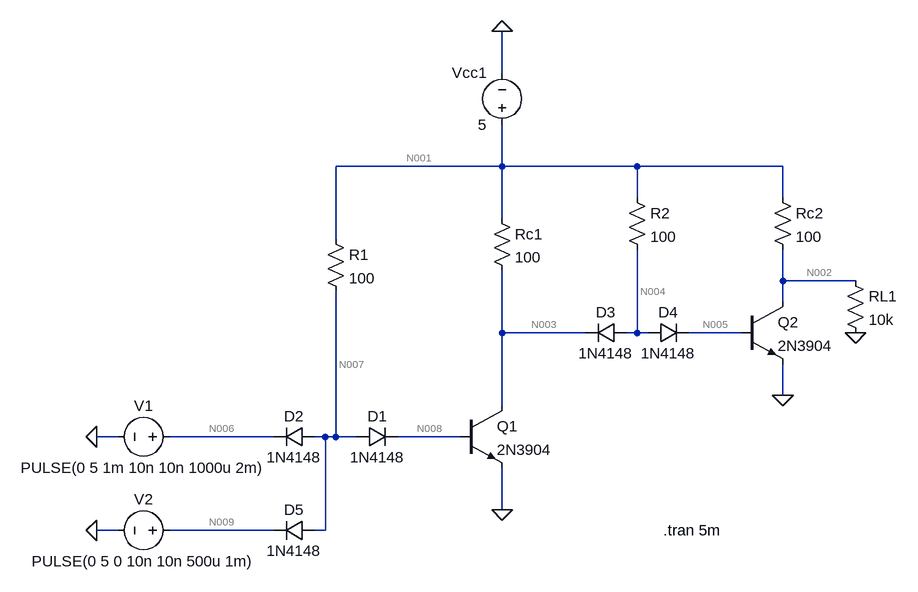
[diagram p0: schematic DTL_AND.asc]
DTL_AND.asc, the LTspice schematic file:
Version 4
SHEET 1 880 680
WIRE 112 -272 112 -336
WIRE 112 -128 112 -192
WIRE 112 -128 -144 -128
WIRE 320 -128 112 -128
WIRE 544 -128 320 -128
WIRE 320 -80 320 -128
WIRE 544 -80 544 -128
WIRE 112 -48 112 -128
WIRE -144 -16 -144 -128
WIRE 544 48 544 0
WIRE 656 48 544 48
WIRE 544 80 544 48
WIRE 112 128 112 32
WIRE 240 128 112 128
WIRE 320 128 320 0
WIRE 320 128 304 128
WIRE 336 128 320 128
WIRE 480 128 400 128
WIRE 544 224 544 176
WIRE 112 240 112 128
WIRE -480 288 -512 288
WIRE -240 288 -400 288
WIRE -160 288 -176 288
WIRE -144 288 -144 64
WIRE -144 288 -160 288
WIRE -112 288 -144 288
WIRE 48 288 -48 288
WIRE 112 400 112 336
WIRE -480 432 -512 432
WIRE -240 432 -400 432
WIRE -160 432 -160 288
WIRE -160 432 -176 432
FLAG -512 288 0
FLAG 112 -336 0
FLAG 112 400 0
FLAG -512 432 0
FLAG 544 224 0
FLAG 656 128 0
SYMBOL diode -112 304 R270
WINDOW 0 32 32 VTop 2
WINDOW 3 0 32 VBottom 2
SYMATTR InstName D1
SYMATTR Value 1N4148
SYMBOL voltage -384 288 R90
WINDOW 0 -32 56 VBottom 2
WINDOW 3 32 56 VTop 2
SYMATTR InstName V1
SYMATTR Value PULSE(0 5 1m 10n 10n 1000u 2m)
SYMBOL res -160 -32 R0
SYMATTR InstName R1
SYMATTR Value 100
SYMBOL voltage 112 -176 R180
WINDOW 0 24 96 Left 2
WINDOW 3 24 16 Left 2
WINDOW 123 0 0 Left 0
WINDOW 39 0 0 Left 0
SYMATTR InstName Vcc1
SYMATTR Value 5
SYMBOL res 96 -64 R0
SYMATTR InstName Rc1
SYMATTR Value 100
SYMBOL npn 48 240 R0
SYMATTR InstName Q1
SYMATTR Value 2N3904
SYMBOL voltage -384 432 R90
WINDOW 0 -32 56 VBottom 2
WINDOW 3 32 56 VTop 2
SYMATTR InstName V2
SYMATTR Value PULSE(0 5 0 10n 10n 500u 1m)
SYMBOL res 304 -96 R0
SYMATTR InstName R2
SYMATTR Value 100
SYMBOL res 528 -96 R0
SYMATTR InstName Rc2
SYMATTR Value 100
SYMBOL npn 480 80 R0
SYMATTR InstName Q2
SYMATTR Value 2N3904
SYMBOL diode -176 272 R90
WINDOW 0 0 32 VBottom 2
WINDOW 3 32 32 VTop 2
SYMATTR InstName D2
SYMATTR Value 1N4148
SYMBOL diode 304 112 R90
WINDOW 0 0 32 VBottom 2
WINDOW 3 32 32 VTop 2
SYMATTR InstName D3
SYMATTR Value 1N4148
SYMBOL diode 336 144 R270
WINDOW 0 32 32 VTop 2
WINDOW 3 0 32 VBottom 2
SYMATTR InstName D4
SYMATTR Value 1N4148
SYMBOL diode -176 416 R90
WINDOW 0 0 32 VBottom 2
WINDOW 3 32 32 VTop 2
SYMATTR InstName D5
SYMATTR Value 1N4148
SYMBOL res 640 32 R0
SYMATTR InstName RL1
SYMATTR Value 10k
TEXT 360 432 Left 2 !.tran 5m

The netlist it stands for:
* DTL_AND.asc
D1 N007 N008 1N4148
V1 N006 0 PULSE(0 5 1m 10n 10n 1000u 2m)
R1 N001 N007 100
Vcc1 N001 0 5
Rc1 N001 N003 100
Q1 N003 N008 0 0 2N3904
V2 N009 0 PULSE(0 5 0 10n 10n 500u 1m)
R2 N001 N004 100
Rc2 N001 N002 100
Q2 N002 N005 0 0 2N3904
D2 N007 N006 1N4148
D3 N004 N003 1N4148
D4 N004 N005 1N4148
D5 N007 N009 1N4148
RL1 N002 0 10k
.model D D
.lib standard.dio
.model NPN NPN
.model PNP PNP
.lib standard.bjt
.tran 5m
.backanno
.end

* Results of the author's LTspice run, read from the files saved beside the schematic
* Operating Point, zero values left out:
*   V(n007) = 734.9 mV
*   V(n008) = 565.4 mV
*   V(n001) = 5 V
*   V(n003) = 4.997 V
*   V(n004) = 2.129 V
*   V(n002) = 30.43 mV
*   V(n005) = 1.377 V
*   Ic(Q2) = 49.69 mA
*   Ib(Q2) = 28.71 mA
*   Ie(Q2) = -78.4 mA
*   Ic(Q1) = 32.51 µA
*   Ib(Q1) = 103.8 nA
*   Ie(Q1) = -32.61 µA
*   I(D5) = 21.33 mA
*   I(D4) = 28.71 mA
*   I(D3) = -2.523 nA
*   I(D2) = 21.33 mA
*   I(D1) = 103.8 nA
*   I(Rl1) = 3.043 µA
*   I(Rc2) = 49.7 mA
*   I(R2) = 28.71 mA
*   I(Rc1) = 32.51 µA
*   I(R1) = 42.65 mA
*   I(V2) = 21.33 mA
*   I(Vcc1) = -121.1 mA
*   I(V1) = 21.33 mA
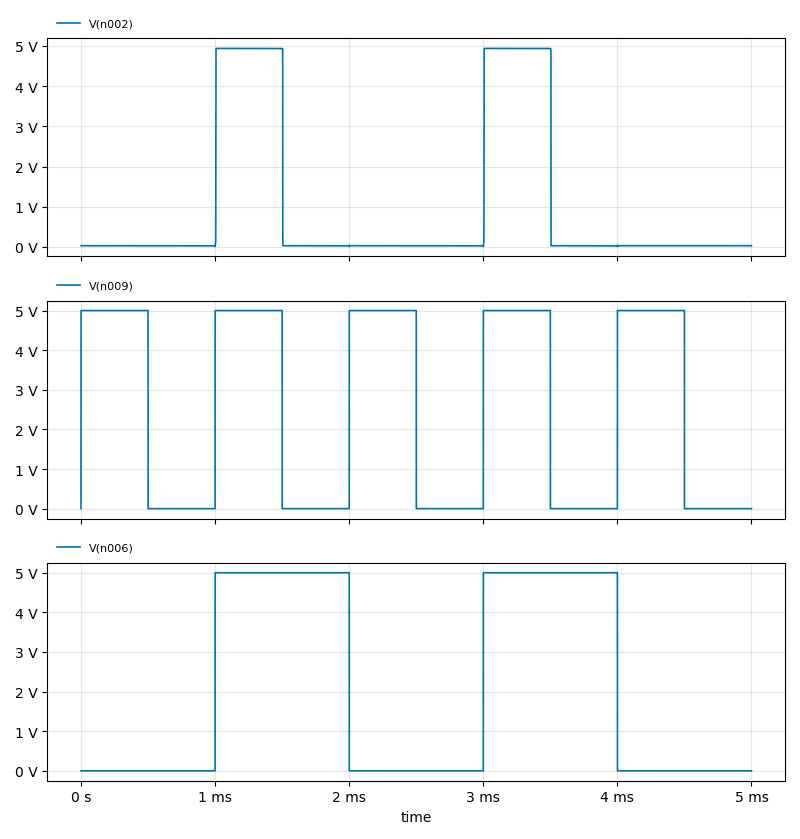
[diagram p1: Transient Analysis of DTL_AND.asc, plotted from the saved traces]
* Transient Analysis, 1 run:
*   V(n002): min 12.69 mV, max 4.941 V, average 1.011 V, rms 2.207 V, last 30.43 mV
*   V(n009): min 0 V, max 5 V, average 2.5 V, rms 3.536 V, last 0 V
*   V(n006): min 0 V, max 5 V, average 2 V, rms 3.162 V, last 0 V